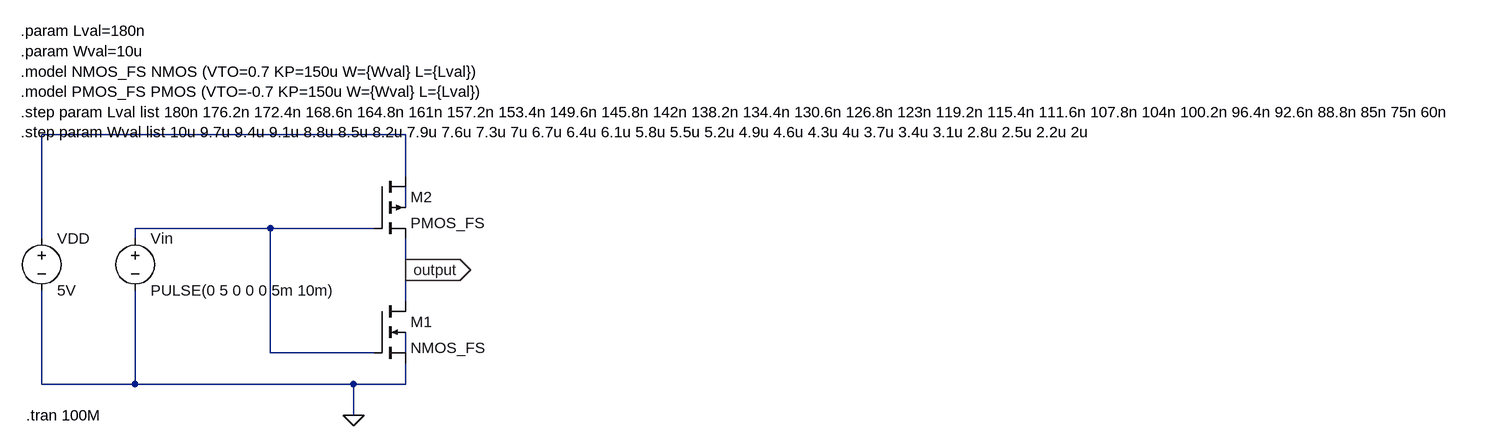
[diagram p0: schematic forksheet_circuit.asc]
forksheet_circuit.asc, the LTspice schematic file:
Version 4
SHEET 1 2240 872
WIRE 320 320 -240 320
WIRE 320 384 320 320
WIRE 320 432 320 400
WIRE 112 464 -96 464
WIRE 272 464 112 464
WIRE -240 480 -240 320
WIRE -96 480 -96 464
WIRE 320 528 320 480
WIRE 320 576 320 528
WIRE 112 656 112 464
WIRE 272 656 112 656
WIRE 320 656 320 624
WIRE -240 704 -240 560
WIRE -96 704 -96 560
WIRE -96 704 -240 704
WIRE 240 704 -96 704
WIRE 320 704 320 672
WIRE 320 704 240 704
WIRE 240 752 240 704
FLAG 240 752 0
FLAG 320 528 output
IOPIN 320 528 Out
SYMBOL voltage -240 464 R0
SYMATTR InstName VDD
SYMATTR Value 5V
SYMBOL voltage -96 464 R0
WINDOW 123 0 0 Left 0
WINDOW 39 0 0 Left 0
SYMATTR InstName Vin
SYMATTR Value PULSE(0 5 0 0 0 5m 10m)
SYMBOL nmos4 272 576 R0
SYMATTR InstName M1
SYMATTR Value NMOS_FS
SYMBOL pmos4 272 384 R0
SYMATTR InstName M2
SYMATTR Value PMOS_FS
TEXT -272 160 Left 2 !.param Lval=180n\n.param Wval=10u\n.model NMOS_FS NMOS (VTO=0.7 KP=150u W={Wval} L={Lval})\n.model PMOS_FS PMOS (VTO=-0.7 KP=150u W={Wval} L={Lval})\n.step param Lval list 180n 176.2n 172.4n 168.6n 164.8n 161n 157.2n 153.4n 149.6n 145.8n 142n 138.2n 134.4n 130.6n 126.8n 123n 119.2n 115.4n 111.6n 107.8n 104n 100.2n 96.4n 92.6n 88.8n 85n 75n 60n\n.step param Wval list 10u 9.7u 9.4u 9.1u 8.8u 8.5u 8.2u 7.9u 7.6u 7.3u 7u 6.7u 6.4u 6.1u 5.8u 5.5u 5.2u 4.9u 4.6u 4.3u 4u 3.7u 3.4u 3.1u 2.8u 2.5u 2.2u 2u
TEXT -264 752 Left 2 !.tran 100M

The netlist it stands for:
* forksheet_circuit.asc
VDD N001 0 5V
Vin N003 0 PULSE(0 5 0 0 0 5m 10m)
M1 output N003 0 N004 NMOS_FS
M2 N001 N003 output N002 PMOS_FS
.model NMOS NMOS
.model PMOS PMOS
.lib standard.mos
.param Lval=180n
.param Wval=10u
.model NMOS_FS NMOS (VTO=0.7 KP=150u W={Wval} L={Lval})
.model PMOS_FS PMOS (VTO=-0.7 KP=150u W={Wval} L={Lval})
.step param Lval list 180n 176.2n 172.4n 168.6n 164.8n 161n 157.2n 153.4n 149.6n 145.8n 142n 138.2n 134.4n 130.6n 126.8n 123n 119.2n 115.4n 111.6n 107.8n 104n 100.2n 96.4n 92.6n 88.8n 85n 75n 60n
.step param Wval list 10u 9.7u 9.4u 9.1u 8.8u 8.5u 8.2u 7.9u 7.6u 7.3u 7u 6.7u 6.4u 6.1u 5.8u 5.5u 5.2u 4.9u 4.6u 4.3u 4u 3.7u 3.4u 3.1u 2.8u 2.5u 2.2u 2u
.tran 100M
.backanno
.end